# EAGLE design bbledtest (EAGLE 7.1.0)
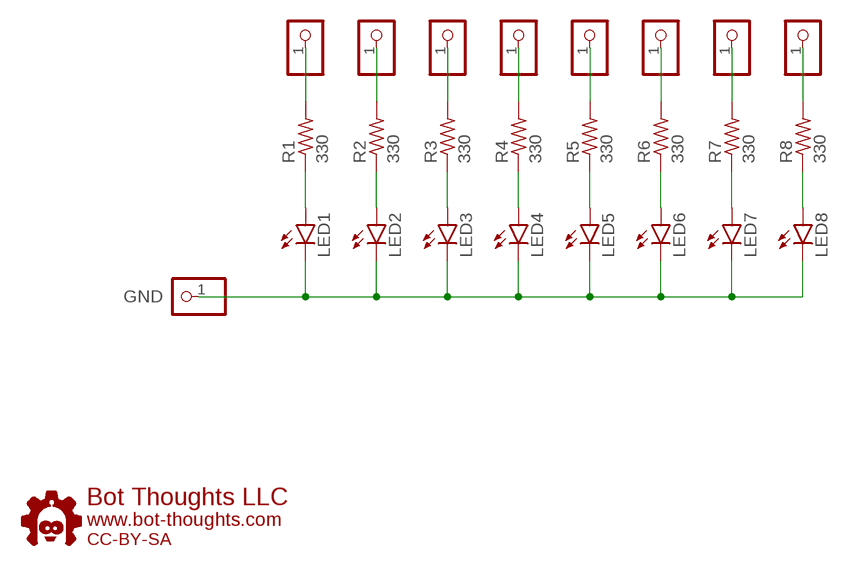
[diagram p0: schematic, sheet 1]

## Parts
JP1  PINHD-1X01_2.54-S  [1X01-S]
JP2  PINHD-1X01_2.54-S  [1X01-S]
JP3  PINHD-1X01_2.54-S  [1X01-S]
JP4  PINHD-1X01_2.54-S  [1X01-S]
JP5  PINHD-1X01_2.54-S  [1X01-S]
JP6  PINHD-1X01_2.54-S  [1X01-S]
JP7  PINHD-1X01_2.54-S  [1X01-S]
JP8  PINHD-1X01_2.54-S  [1X01-S]
JP9  GND  PINHD-1X01_2.54-S  [1X01-S]
LED1  LEDCHIPLED_1206  [CHIPLED_1206]
LED2  LEDCHIPLED_1206  [CHIPLED_1206]
LED3  LEDCHIPLED_1206  [CHIPLED_1206]
LED4  LEDCHIPLED_1206  [CHIPLED_1206]
LED5  LEDCHIPLED_1206  [CHIPLED_1206]
LED6  LEDCHIPLED_1206  [CHIPLED_1206]
LED7  LEDCHIPLED_1206  [CHIPLED_1206]
LED8  LEDCHIPLED_1206  [CHIPLED_1206]
R1  330  R0603  [0603]
R2  330  R0603  [0603]
R3  330  R0603  [0603]
R4  330  R0603  [0603]
R5  330  R0603  [0603]
R6  330  R0603  [0603]
R7  330  R0603  [0603]
R8  330  R0603  [0603]
U$1  BTLOGO-LOGO-MD  [BTLOGOM]

## Nets
N$1: LED5.A R5.1
N$2: LED4.A R4.1
N$3: LED3.A R3.1
N$4: LED2.A R2.1
N$5: LED1.A R1.1
N$6: LED7.A R7.1
N$7: LED6.A R6.1
N$8: LED8.A R8.1
N$9: JP1.1 R1.2
N$10: JP2.1 R2.2
N$11: JP3.1 R3.2
N$12: JP4.1 R4.2
N$13: JP6.1 R6.2
N$14: JP7.1 R7.2
N$15: JP5.1 R5.2
N$16: JP8.1 R8.2
N$17: JP9.1 LED1.C LED2.C LED3.C LED4.C LED5.C LED6.C LED7.C LED8.C

## Library data of the parts
JP1-JP9 = bt_electromech:PINHD-1X01: PIN HEADER Generic pin header in a variety of footprints
LED1-LED8 = bt_opto:LED: LED Various packages
R1-R8 = bt_rcl:R: Resistor, American symbol
U$1 = bt:BTLOGO: Bot Thoughts Logo

## Board
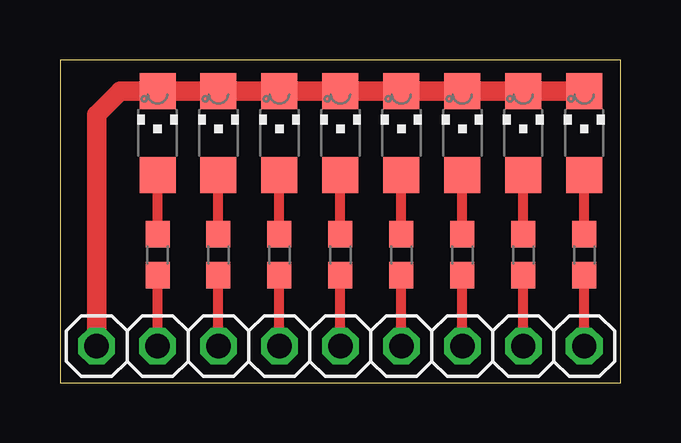
[diagram p1: board, top side]

Size 23.37 x 13.46 mm. Coordinates in mm from the lower left corner, seen from the top.
Outline: 0,0 23.37,0 23.37,13.46 0,13.46 0,0
Copper layers (1*16): Top 0.035mm / dielectric 1.5mm / Bottom 0.035mm
Design rules "default": minimum track width 10mil, minimum drill 24mil, track to track 8mil, track to pad 8mil, pad to pad 8mil, via to via 8mil, smd to smd 8mil, copper to edge 40mil, drill to drill 8mil, minimum pad ring 10mil, minimum via ring 8mil, stop-mask expansion 4mil, vias tented up to drill 0mil, thermal gap 10mil

### Footprints (pad centres in the part's own frame; a part is rotated, then mirrored left to right if it is on the bottom)
1X01-S = drill 1.016 octagon: 1 0,0
CHIPLED_1206 = smd 1.5 x 1.5: A 0,-1.75; C 0,1.75
0603 = smd 1.1 x 1: 1 -0.85,0; 2 0.85,0

### Placement (x,y rotation side)
JP1  4.06,1.52 0 top
JP2  6.6,1.52 0 top
JP3  9.14,1.52 0 top
JP4  11.68,1.52 0 top
JP5  14.22,1.52 0 top
JP6  16.76,1.52 0 top
JP7  19.3,1.52 0 top
JP8  21.84,1.52 0 top
JP9  1.52,1.52 90 top
LED1  4.06,10.41 0 top
LED2  6.6,10.41 0 top
LED3  9.14,10.41 0 top
LED4  11.68,10.41 0 top
LED5  14.22,10.41 0 top
LED6  16.76,10.41 0 top
LED7  19.3,10.41 0 top
LED8  21.84,10.41 0 top
R1  4.06,5.33 270 top
R2  6.6,5.33 270 top
R3  9.14,5.33 270 top
R4  11.68,5.33 270 top
R5  14.22,5.33 270 top
R6  16.76,5.33 270 top
R7  19.3,5.33 270 top
R8  21.84,5.33 270 top
U$1  11.68,5.33 0 bottom

### Tracks (layer width: path | path; a pad name or v marks a point on that pad's centre or on a via)
N$1
  Top 0.406: R5.1 LED5.A
N$2
  Top 0.406: R4.1 LED4.A
N$3
  Top 0.406: R3.1 LED3.A
N$4
  Top 0.406: R2.1 LED2.A
N$5
  Top 0.406: R1.1 LED1.A
N$6
  Top 0.406: R7.1 LED7.A
N$7
  Top 0.406: R6.1 LED6.A
N$8
  Top 0.406: R8.1 LED8.A
N$9
  Top 0.406: JP1.1 R1.2
N$10
  Top 0.406: JP2.1 R2.2
N$11
  Top 0.406: JP3.1 R3.2
N$12
  Top 0.406: JP4.1 R4.2
N$13
  Top 0.406: JP6.1 R6.2
N$14
  Top 0.406: JP7.1 R7.2
N$15
  Top 0.406: JP5.1 R5.2
N$16
  Top 0.406: JP8.1 R8.2
N$17
  Top 0.813: JP9.1 1.52,11.18 2.51,12.16 LED1.C LED2.C LED3.C LED4.C LED5.C LED6.C LED7.C LED8.C

### Text on the board
bNames: LED Test Array | CC-BY-SA | www.bot-thoughts.com